# EAGLE design alimentation-1 (EAGLE 7.6.0)
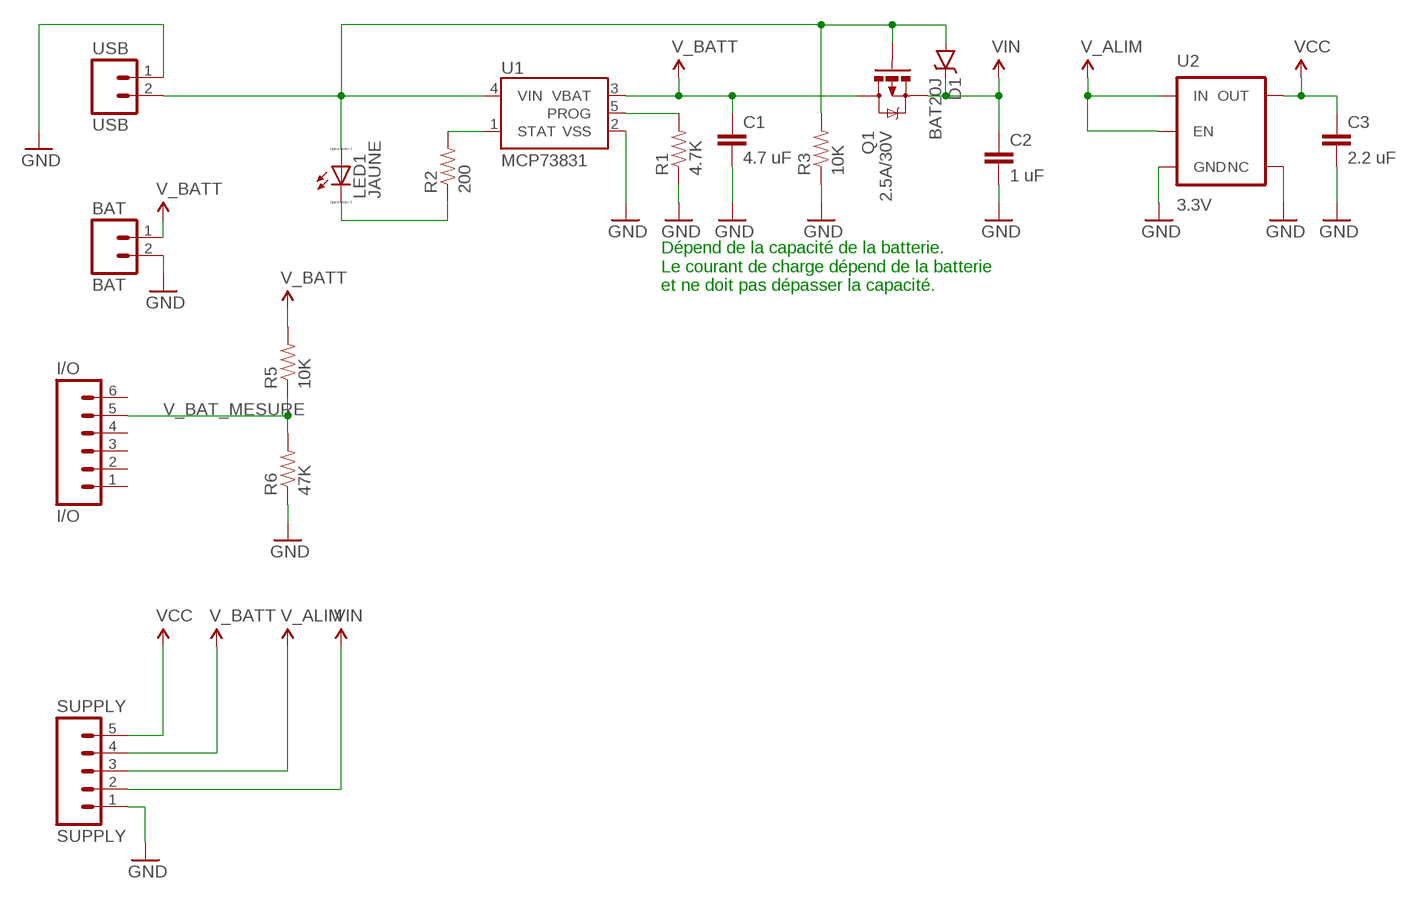
[diagram p0: schematic, sheet 1]

## Parts
BAT  BAT  M021X02_NO_SILK  [1X02_NO_SILK]
C1  4.7 uF  CAP0805  [0805]
C2  1 uF  CAP0805  [0805]
C3  2.2 uF  CAP0805  [0805]
D1  BAT20J  DIODE-SCHOTTKY-BAT20J  [SOD-323]
I/O  I/O  M06NO_SILK_FEMALE_PTH  [1X06_NO_SILK]
LED1  JAUNE  LED_E  [LED_1206]
Q1  2.5A/30V  MOSFET-PCHANNELDMG2307L  [SOT23-3]
R1  4.7K  RESISTOR0805-RES  [0805]
R2  200  RESISTOR0805-RES  [0805]
R3  10K  RESISTOR0805-RES  [0805]
R5  10K  RESISTOR0805-RES  [0805]
R6  47K  RESISTOR0805-RES  [0805]
SUPPLY  SUPPLY  M05NO_SILK  [1X05_NO_SILK]
U1  MCP73831  [SOT23-5]
U2  3.3V  V_REG_AP2112K-3.3V  [SOT23-5]
USB  USB  M021X02_NO_SILK  [1X02_NO_SILK]

## Nets
GND: BAT.2 C1.2 C2.2 C3.2 R1.1 R3.1 R6.1 SUPPLY.1 U1.2(VSS) U2.2(GND) U2.4(NC) USB.1
N$1: LED1.C R2.1
N$2: R1.2 U1.5(PROG)
N$4: R2.2 U1.1(STAT)
V_BAT_MESURE: I/O.5 R5.1 R6.2
V_BATT [SUPPLY]: BAT.1 C1.1 Q1.3(D) R5.2 SUPPLY.4 U1.3(VBAT)
VCC [SUPPLY]: C3.1 SUPPLY.5 U2.5(OUT)
VCC_2 [SUPPLY]: SUPPLY.3 U2.1(IN) U2.3(EN) ; supply symbol labelled V_ALIM
VIN [SUPPLY]: C2.1 D1.C Q1.2(S) SUPPLY.2
VUSB [SUPPLY]: D1.A LED1.A Q1.1(G) R3.2 U1.4(VIN) USB.2
Unconnected: I/O.1 I/O.2 I/O.3 I/O.4 I/O.6

## Notes on the sheet
- Dépend de la capacité de la batterie. 
  Le courant de charge dépend de la batterie 
  et ne doit pas dépasser la capacité.

## Library data of the parts
BAT USB = SparkFun-Connectors:M02: Standard 2-pin 0.1" header. Use with - straight break away headers ( PRT-00116) - right angle break away headers (PRT-00553) - swiss pins (PRT-00743) - machine pins (PRT-00117) - female headers (PRT-00115) Molex polarized connector foot print use with: PRT-08233 with associated crimp pins and housings. 2.54_SCREWTERM for use with PRT-10571. 3.5mm Screw Terminal footprints for PRT-08084 5mm Screw Terminal footprints for use with PRT-08432
C1-C3 = SparkFun-Capacitors:CAP: Capacitor Standard 0603 ceramic capacitor, and 0.1" leaded capacitor.
D1 = SparkFun-DiscreteSemi:DIODE-SCHOTTKY: Schottky diodes in SFE's production catalog BAT20J 1A 23V 0.62Vf RB751 120mA 40V 0.37Vf PMEG4005EJ 0.5A 40V 0.42Vf MBRA140 1A 40V 0.5Vf B340A 3A 40V SMA; PROD_ID: DIO-11623
I/O = SparkFun-Connectors:M06: Header 6 Standard 6-pin 0.1" header. Use with straight break away headers (SKU : PRT-00116), right angle break away headers (PRT-00553), swiss pins (PRT-00743), machine pins (PRT-00117), and female headers (PRT-00115). Molex polarized connector foot print use with SKU : PRT-08094 with associated crimp pins and housings. NOTES ON THE VARIANTS LOCK and LOCK_LONGPADS... This footprint was designed to help hold the alignment of a through-hole component (i.e. 6-pin header) while soldering it into place. You may notice that each hole has been shifted either up or down by 0.005 of an inch from it's more standard position (which is a perfectly straight line). This slight alteration caused the pins (the squares in the middle) to touch the edges of the holes. Because they are alternating, it causes a "brace" to hold the component in place. 0.005 has proven to be the perfect amount of "off-center" position when using our standard breakaway headers. Although looks a little odd when you look at the bare footprint, once you have a header in there, the alteration is very hard to notice. Also,if you push a header all the way into place, it is covered up entirely on the bottom side. This idea of altering the position of holes to aid alignment will be further integrated into the Sparkfun Library for other footprints. It can help hold any component with 3 or more connection pins.; PROD_ID: CONN-08437
LED1 = eagle-ltspice:LED_E: LED Source: http://www.osram.convergy.de Source: www.luxeon.com Source: www.kingbright.com; SPICEMODEL: NONE; SPICEPREFIX: D; SPICETYPE: diode
Q1 = SparkFun-DiscreteSemi:MOSFET-PCHANNEL: Generic PMOSFET IRLML2244 - TRANS-11153 (SOT-23 -20V -4.3A) (1.Gate 2.Source 3.Drain) FQP27P06 - COM-10349 <http://www.sparkfun.com/products/10349> (TO-220 -60V -27A) (1.Gate 2.Source 3.Drain); PROD_ID: TRANS-11308
R1-R3 R5 R6 = SparkFun-Passives:RESISTOR: Resistor Basic schematic elements and footprints for 0603, 1206, and PTH resistors.
SUPPLY = SparkFun-Connectors:M05: Header 5 Standard 5-pin 0.1" header. Use with straight break away headers (SKU : PRT-00116), right angle break away headers (PRT-00553), swiss pins (PRT-00743), machine pins (PRT-00117), and female headers (PRT-00115). Molex polarized connector foot print use with SKU : PRT-08230 with associated crimp pins and housings.
U1 = SparkFun-PowerIC:MCP73831: Miniature single cell, fully integrated Li-Ion, Li-polymer charge management controller http://ww1.microchip.com/downloads/en/DeviceDoc/20001984g.pdf IC-09995; PROD_ID: IC-09995
U2 = SparkFun-PowerIC:V_REG_AP2112: AP2112 - 600mA CMOS LDO Regulator w/ Enable The AP2112 is CMOS process low dropout linear regulator with enable function, the regulator delivers a guaranteed 600mA (min.) continuous load current. Features Output Voltage Accuracy: ±1.5% Output Current: 600mA (Min.) Foldback Short Current Protection: 50mA Enable Function to Turn ON/OFF VOUT Low Dropout Voltage (3.3V): 250mV (Typ.) @IOUT=600mA Excellent Load Regulation: 0.2%/A (Typ.) Excellent Line Regulation: 0.02%/V (Typ.) Low Quiescent Current: 55μA (Typ.) Low Standby Current: 0.01μA (Typ.) Low Output Noise: 50μVRMS PSRR: 100Hz -65dB, 1kHz -65dB OTSD Protection Stable with 1.0μF Flexible Cap: Ceramic, Tantalum and Aluminum Electrolytic Operation Temperature Range: -40°C to 85°C ESD: MM 400V, HBM 4000V; PROD_ID: VREG-12457

## Net classes
1 SUPPLY: width 0.5 mm, drill 0.2 mm, clearance 0.5 mm

## Board
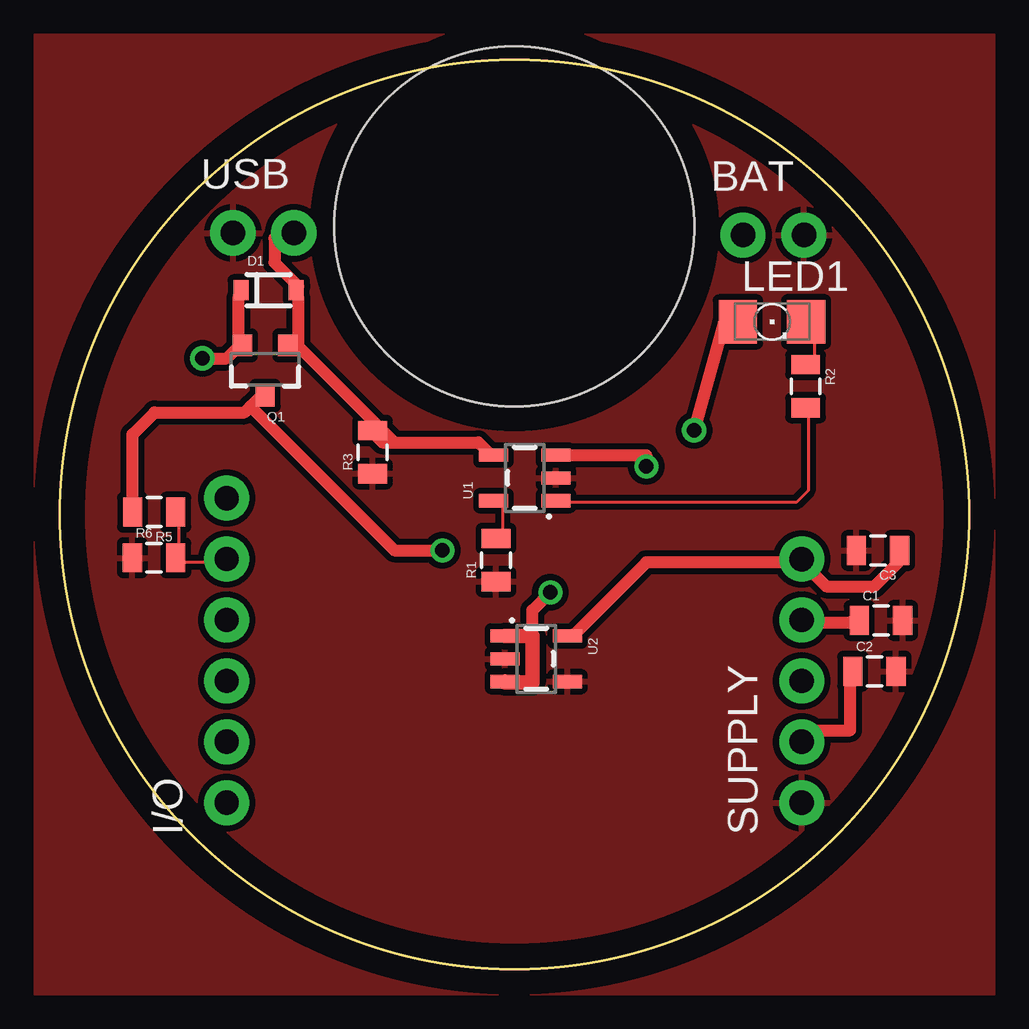
[diagram p1: board, top side]
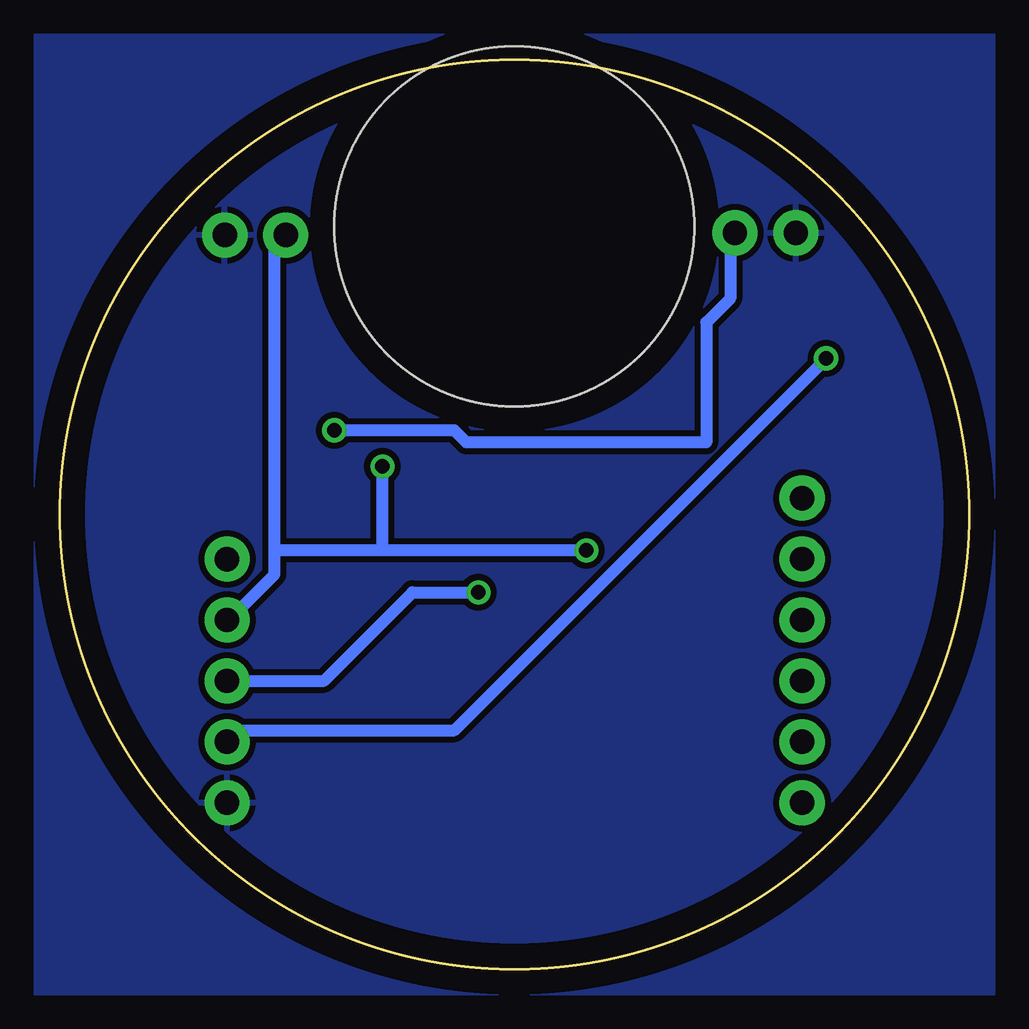
[diagram p2: board, bottom side, seen from below]

Size 37.89 x 37.89 mm. Coordinates in mm from the lower left corner, seen from the top.
Outline: circle at 18.94,18.94 radius 18.94
Copper layers (1*16): Top 0.035mm / dielectric 1.5mm / Bottom 0.035mm
Design rules "baballe": minimum track width 5mil, minimum drill 24mil, track to track 4mil, track to pad 4mil, pad to pad 4mil, via to via 4mil, smd to smd 2mil, copper to edge 40mil, drill to drill 8mil, minimum pad ring 10mil, minimum via ring 8mil, stop-mask expansion 4mil, vias tented up to drill 0mil, thermal gap 10mil
Holes 15 mm at 18.94,30.94

### Footprints (pad centres in the part's own frame; a part is rotated, then mirrored left to right if it is on the bottom)
1X02_NO_SILK = drill 1.016 pad 1.88: 1 0,0; 2 2.54,0
0805 = smd 0.8 x 1.2: 1 -0.9,0; 2 0.9,0
SOD-323 = smd 0.63 x 0.83: A 1.15,0; C -1.15,0
1X06_NO_SILK = drill 1.016 pad 1.88: 1 0,0; 2 2.54,0; 3 5.08,0; 4 7.62,0; 5 10.16,0; 6 12.7,0
LED_1206 = smd 1.6 x 1.803: A -1.422,0; C 1.422,0
SOT23-3 = smd 0.8 x 0.9: 1 -0.95,-1; 2 0.95,-1; 3 0,1.1
1X05_NO_SILK = drill 1.016 pad 1.88: 1 0,0; 2 2.54,0; 3 5.08,0; 4 7.62,0; 5 10.16,0
SOT23-5 = smd 0.55 x 1.2: 1 -0.95,-1.3; 2 0,-1.3; 3 0.95,-1.3; 4 0.95,1.3; 5 -0.95,1.3

### Placement (x,y rotation side)
BAT  28.47,30.59 0 top
C1  34.23,14.52 0 top
C2  33.95,12.4 0 top
C3  34.1,17.44 180 top
D1  8.7,28.29 0 top
I/O  6.95,6.92 90 top
LED1  29.68,26.97 0 top
Q1  8.55,24.99 180 top
R1  18.18,17.04 90 top
R2  31.08,24.28 270 top
R3  13.03,21.54 90 top
R5  3.93,19.04 180 top
R6  3.92,17.13 0 top
SUPPLY  30.92,6.92 90 top
U1  19.37,20.46 90 top
U2  19.85,12.92 270 top
USB  7.21,30.68 0 top

### Tracks (layer width: path | path; a pad name or v marks a point on that pad's centre or on a via)
GND
  Bottom 0.127: USB.1 6.94,30.94 7.16,30.94
  pour Top (isolate 0.254): -1.06,38.94 38.94,38.94 38.94,-1.06 -1.06,-1.06
  pour Bottom (isolate 0.254): -1.06,38.94 38.94,38.94 38.94,-1.06 -1.06,-1.06
N$1
  Top 0.127: R2.1 31.44,25.44 31.44,26.94 LED1.C
N$2
  Top 0.127: R1.2 18.44,17.94 18.44,19.44 U1.5
N$4
  Top 0.127: U1.1 20.94,19.44 30.69,19.44 31.19,19.94 31.19,23.44 R2.2
V_BAT_MESURE
  Top 0.127: R5.1 4.94,18.44 4.94,17.44 R6.2 4.94,16.94 6.94,16.94 I/O.5
V_BATT  (via drill 0.6)
  Top 0.5: 7.94,23.44 8.44,23.94 Q1.3 | C1.1 32.94,14.44 30.94,14.44 SUPPLY.4 30.44,14.44 | 7.94,23.44 13.94,17.44 v15.94,17.44 | U1.3 24.44,21.41 v24.44,20.94 | R5.2 3.03,22.28 3.94,23.19 7.69,23.19 7.94,23.44
  Bottom 0.5: 28.94,17.44 28.94,16.44 30.44,14.94 SUPPLY.4 | 28.94,17.44 28.94,30.44 BAT.1 | 24.44,17.44 28.94,17.44 | v15.94,17.44 24.44,17.44 | 24.44,17.44 v24.44,20.94
VCC
  Top 0.5: U2.5 21.44,13.94 24.44,16.94 30.44,16.94 SUPPLY.5 30.94,16.94 31.94,15.94 33.94,15.94 34.94,16.94 C3.1
VCC_2  (via drill 0.6)
  Top 0.5: 19.69,13.87 19.69,14.94 v20.44,15.69
  Top 0.61: U2.1 19.69,13.87 19.69,11.94 18.55,11.94 U2.3
  Bottom 0.5: SUPPLY.3 26.88,12 23.19,15.69 v20.44,15.69
VIN  (via drill 0.61)
  Top 0.5: 7.44,25.94 7.44,27.94 D1.C | C2.1 32.94,11.94 32.94,9.94 30.94,9.94 SUPPLY.2 | 7.44,25.94 6.94,25.44 v5.94,25.44 | 7.44,25.94 Q1.2
  Bottom 0.5: v5.94,25.44 21.44,9.94 30.44,9.94 SUPPLY.2
VUSB  (via drill 0.61)
  Top 0.5: 9.94,25.94 9.94,27.94 D1.A 9.94,28.44 8.94,29.44 8.94,30.44 9.44,30.44 USB.2 | 9.94,25.94 9.44,25.94 Q1.1 | 13.94,21.94 13.44,21.94 12.94,22.44 R3.2 | 13.94,21.94 17.44,21.94 17.94,21.44 U1.4 | 13.94,21.94 9.94,25.94 | v26.44,22.44 27.69,26.94 LED1.A
  Bottom 0.5: v26.44,22.44 21.44,22.44 20.94,21.94 10.94,21.94 10.94,26.94 9.94,27.94 9.94,30.44 USB.2